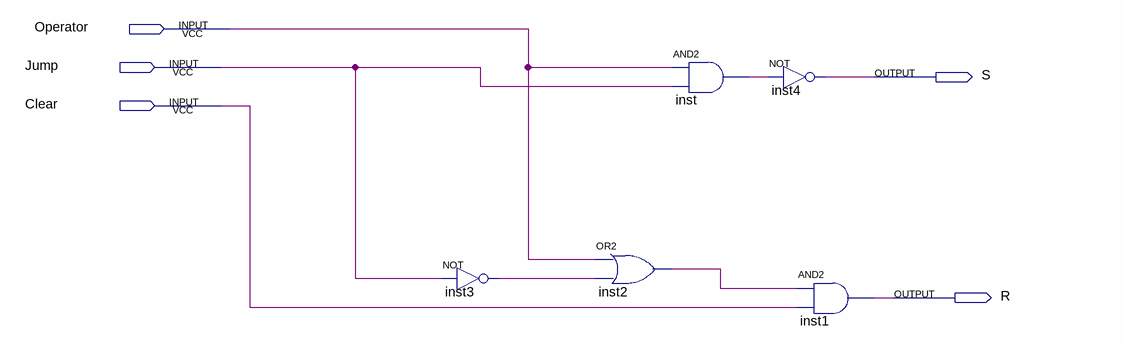
[diagram p0: schematic sheet]
// Quartus schematic Jump.bdf as structural Verilog: 5 symbols, 5 pins
module Jump (
  input  Operator,
  input  Jump,
  input  Clear,
  output S,
  output R
);

  wire inst2_out, inst3_out, inst_out;

  not inst3 (inst3_out, Jump);
  or inst2 (inst2_out, Operator, inst3_out);
  and inst (inst_out, Operator, Jump);
  not inst4 (S, inst_out);
  and inst1 (R, inst2_out, Clear);
endmodule
